# Altium schematic sheet WSB.SchDoc
size A; SheetNumber: 1; SheetTotal: 11
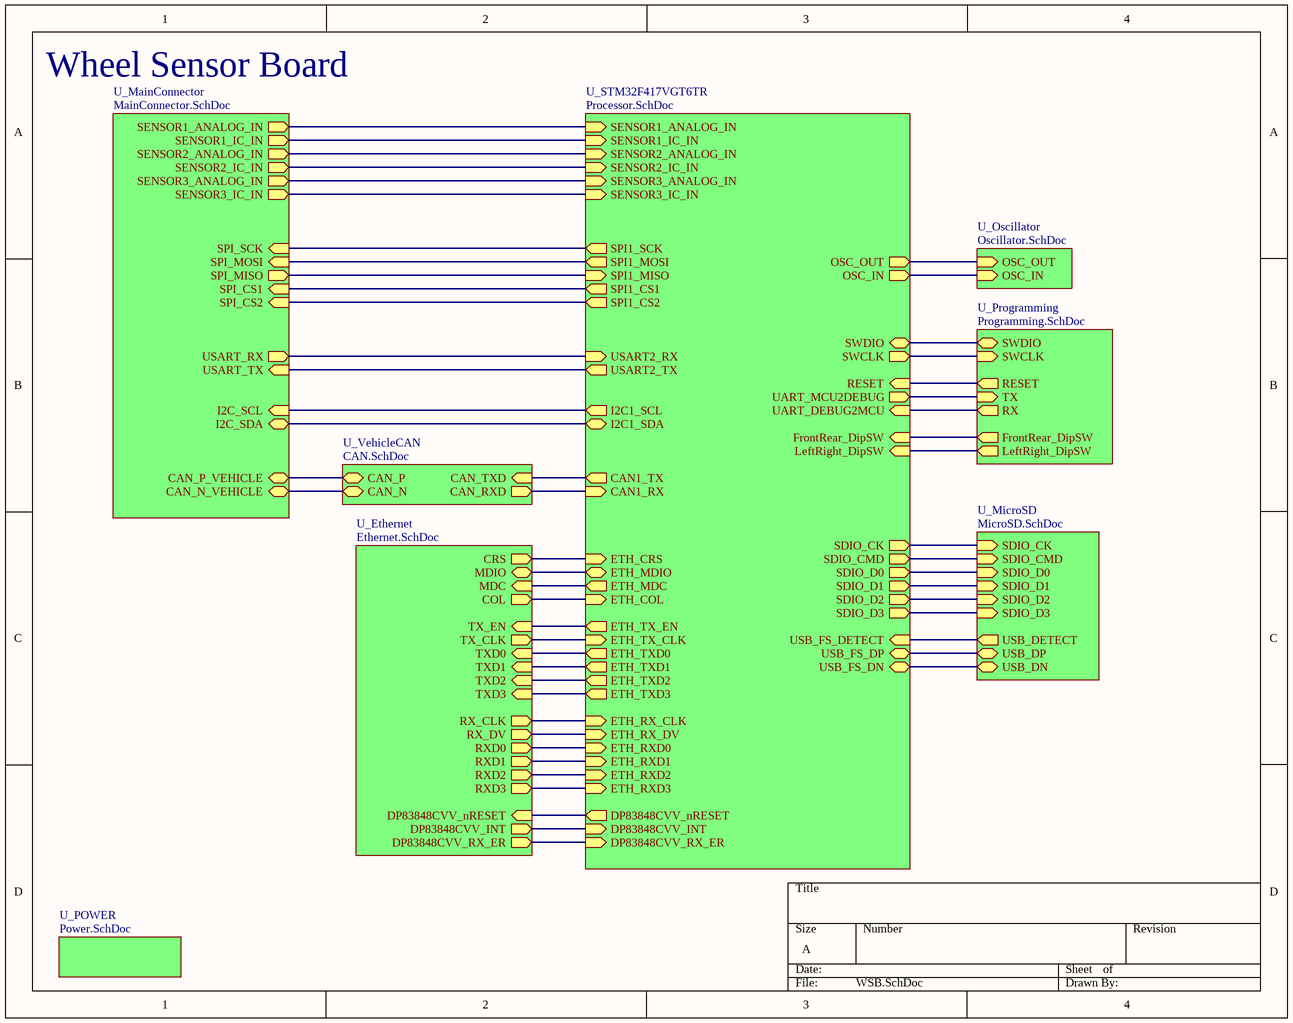
[diagram p0: WSB.SchDoc]

## Sub-sheets
U_Ethernet = Ethernet.SchDoc: DP83848CVV_INT (out), DP83848CVV_nRESET (in), CRS (out), RX_CLK (out), MDIO (bidir), COL (out), RX_DV (out), RXD2 (out), RXD3 (out), TX_EN (in), TXD0 (in), TXD1 (in), MDC (in), TXD2 (in), TX_CLK (out), RXD0 (out), RXD1 (out), TXD3 (in), DP83848CVV_RX_ER (out)
U_MainConnector = MainConnector.SchDoc: CAN_N_VEHICLE (bidir), CAN_P_VEHICLE (bidir), I2C_SDA (bidir), I2C_SCL (in), USART_TX (in), USART_RX (out), SPI_SCK (in), SPI_MOSI (in), SPI_MISO (out), SPI_CS1 (in), SPI_CS2 (in), SENSOR1_ANALOG_IN (out), SENSOR1_IC_IN (out), SENSOR2_ANALOG_IN (out), SENSOR2_IC_IN (out), SENSOR3_ANALOG_IN (out), SENSOR3_IC_IN (out)
U_MicroSD = MicroSD.SchDoc: SDIO_CK (in), SDIO_CMD (in), SDIO_D0 (in), SDIO_D1 (in), SDIO_D2 (in), SDIO_D3 (in), USB_DETECT (out), USB_DN (bidir), USB_DP (bidir)
U_Oscillator = Oscillator.SchDoc: OSC_IN (in), OSC_OUT (in)
U_POWER = Power.SchDoc: no entries
U_Programming = Programming.SchDoc: SWDIO (bidir), SWCLK (in), RESET (out), TX (in), RX (out), FrontRear_DipSW (out), LeftRight_DipSW (out)
U_STM32F417VGT6TR = Processor.SchDoc: SDIO_D0 (out), SDIO_D1 (out), SDIO_D2 (out), SDIO_D3 (out), SDIO_CK (out), SDIO_CMD (out), ETH_MDC (out), ETH_MDIO (bidir), I2C1_SCL (out), I2C1_SDA (bidir), SWDIO (bidir), SWCLK (out), UART_DEBUG2MCU (in), UART_MCU2DEBUG (out), CAN1_TX (out), RESET (in), ETH_COL (in), ETH_CRS (in), ETH_RXD0 (in), ETH_RXD1 (in), ETH_RXD2 (in), ETH_RXD3 (in), ETH_RX_CLK (in), ETH_RX_DV (in), ETH_TXD0 (out), ETH_TXD1 (out), ETH_TXD2 (out), ETH_TXD3 (out), ETH_TX_CLK (in), ETH_TX_EN (out), USB_FS_DN (bidir), USB_FS_DP (bidir), OSC_OUT (out), OSC_IN (out), USB_FS_DETECT (in), DP83848CVV_INT (in), DP83848CVV_nRESET (out), DP83848CVV_RX_ER (in), SPI1_SCK (out), SPI1_MOSI (out), USART2_TX (out), USART2_RX (in), SENSOR1_ANALOG_IN (in), SENSOR1_IC_IN (in), SPI1_MISO (in), SENSOR2_ANALOG_IN (in), SENSOR3_ANALOG_IN (in), SENSOR2_IC_IN (in), SENSOR3_IC_IN (in), FrontRear_DipSW (in), LeftRight_DipSW (in), CAN1_RX (in), SPI1_CS1 (out), SPI1_CS2 (out)
U_VehicleCAN = CAN.SchDoc: CAN_P (bidir), CAN_N (bidir), CAN_TXD (in), CAN_RXD (out)

## Nets
(unnamed): sheet U_MicroSD/SDIO_CK, sheet U_STM32F417VGT6TR/SDIO_CK
(unnamed): sheet U_MicroSD/SDIO_CMD, sheet U_STM32F417VGT6TR/SDIO_CMD
(unnamed): sheet U_MicroSD/SDIO_D0, sheet U_STM32F417VGT6TR/SDIO_D0
(unnamed): sheet U_MicroSD/SDIO_D1, sheet U_STM32F417VGT6TR/SDIO_D1
(unnamed): sheet U_MicroSD/SDIO_D2, sheet U_STM32F417VGT6TR/SDIO_D2
(unnamed): sheet U_MicroSD/SDIO_D3, sheet U_STM32F417VGT6TR/SDIO_D3
(unnamed): sheet U_MicroSD/USB_DETECT, sheet U_STM32F417VGT6TR/USB_FS_DETECT
(unnamed): sheet U_MicroSD/USB_DN, sheet U_STM32F417VGT6TR/USB_FS_DN
(unnamed): sheet U_MicroSD/USB_DP, sheet U_STM32F417VGT6TR/USB_FS_DP
(unnamed): sheet U_Programming/SWDIO, sheet U_STM32F417VGT6TR/SWDIO
(unnamed): sheet U_Programming/SWCLK, sheet U_STM32F417VGT6TR/SWCLK
(unnamed): sheet U_Programming/RESET, sheet U_STM32F417VGT6TR/RESET
(unnamed): sheet U_Programming/TX, sheet U_STM32F417VGT6TR/UART_MCU2DEBUG
(unnamed): sheet U_Programming/RX, sheet U_STM32F417VGT6TR/UART_DEBUG2MCU
(unnamed): sheet U_Programming/FrontRear_DipSW, sheet U_STM32F417VGT6TR/FrontRear_DipSW
(unnamed): sheet U_Programming/LeftRight_DipSW, sheet U_STM32F417VGT6TR/LeftRight_DipSW
(unnamed): sheet U_VehicleCAN/CAN_P, sheet U_MainConnector/CAN_P_VEHICLE
(unnamed): sheet U_VehicleCAN/CAN_N, sheet U_MainConnector/CAN_N_VEHICLE
(unnamed): sheet U_VehicleCAN/CAN_TXD, sheet U_STM32F417VGT6TR/CAN1_TX
(unnamed): sheet U_VehicleCAN/CAN_RXD, sheet U_STM32F417VGT6TR/CAN1_RX
(unnamed): sheet U_Oscillator/OSC_IN, sheet U_STM32F417VGT6TR/OSC_IN
(unnamed): sheet U_Oscillator/OSC_OUT, sheet U_STM32F417VGT6TR/OSC_OUT
(unnamed): sheet U_STM32F417VGT6TR/ETH_MDC, sheet U_Ethernet/MDC
(unnamed): sheet U_STM32F417VGT6TR/ETH_MDIO, sheet U_Ethernet/MDIO
(unnamed): sheet U_STM32F417VGT6TR/I2C1_SCL, sheet U_MainConnector/I2C_SCL
(unnamed): sheet U_STM32F417VGT6TR/I2C1_SDA, sheet U_MainConnector/I2C_SDA
(unnamed): sheet U_STM32F417VGT6TR/ETH_COL, sheet U_Ethernet/COL
(unnamed): sheet U_STM32F417VGT6TR/ETH_CRS, sheet U_Ethernet/CRS
(unnamed): sheet U_STM32F417VGT6TR/ETH_RXD0, sheet U_Ethernet/RXD0
(unnamed): sheet U_STM32F417VGT6TR/ETH_RXD1, sheet U_Ethernet/RXD1
(unnamed): sheet U_STM32F417VGT6TR/ETH_RXD2, sheet U_Ethernet/RXD2
(unnamed): sheet U_STM32F417VGT6TR/ETH_RXD3, sheet U_Ethernet/RXD3
(unnamed): sheet U_STM32F417VGT6TR/ETH_RX_CLK, sheet U_Ethernet/RX_CLK
(unnamed): sheet U_STM32F417VGT6TR/ETH_RX_DV, sheet U_Ethernet/RX_DV
(unnamed): sheet U_STM32F417VGT6TR/ETH_TXD0, sheet U_Ethernet/TXD0
(unnamed): sheet U_STM32F417VGT6TR/ETH_TXD1, sheet U_Ethernet/TXD1
(unnamed): sheet U_STM32F417VGT6TR/ETH_TXD2, sheet U_Ethernet/TXD2
(unnamed): sheet U_STM32F417VGT6TR/ETH_TXD3, sheet U_Ethernet/TXD3
(unnamed): sheet U_STM32F417VGT6TR/ETH_TX_CLK, sheet U_Ethernet/TX_CLK
(unnamed): sheet U_STM32F417VGT6TR/ETH_TX_EN, sheet U_Ethernet/TX_EN
(unnamed): sheet U_STM32F417VGT6TR/DP83848CVV_INT, sheet U_Ethernet/DP83848CVV_INT
(unnamed): sheet U_STM32F417VGT6TR/DP83848CVV_nRESET, sheet U_Ethernet/DP83848CVV_nRESET
(unnamed): sheet U_STM32F417VGT6TR/DP83848CVV_RX_ER, sheet U_Ethernet/DP83848CVV_RX_ER
(unnamed): sheet U_STM32F417VGT6TR/SPI1_SCK, sheet U_MainConnector/SPI_SCK
(unnamed): sheet U_STM32F417VGT6TR/SPI1_MOSI, sheet U_MainConnector/SPI_MOSI
(unnamed): sheet U_STM32F417VGT6TR/USART2_TX, sheet U_MainConnector/USART_TX
(unnamed): sheet U_STM32F417VGT6TR/USART2_RX, sheet U_MainConnector/USART_RX
(unnamed): sheet U_STM32F417VGT6TR/SENSOR1_ANALOG_IN, sheet U_MainConnector/SENSOR1_ANALOG_IN
(unnamed): sheet U_STM32F417VGT6TR/SENSOR1_IC_IN, sheet U_MainConnector/SENSOR1_IC_IN
(unnamed): sheet U_STM32F417VGT6TR/SPI1_MISO, sheet U_MainConnector/SPI_MISO
(unnamed): sheet U_STM32F417VGT6TR/SENSOR2_ANALOG_IN, sheet U_MainConnector/SENSOR2_ANALOG_IN
(unnamed): sheet U_STM32F417VGT6TR/SENSOR3_ANALOG_IN, sheet U_MainConnector/SENSOR3_ANALOG_IN
(unnamed): sheet U_STM32F417VGT6TR/SENSOR2_IC_IN, sheet U_MainConnector/SENSOR2_IC_IN
(unnamed): sheet U_STM32F417VGT6TR/SENSOR3_IC_IN, sheet U_MainConnector/SENSOR3_IC_IN
(unnamed): sheet U_STM32F417VGT6TR/SPI1_CS1, sheet U_MainConnector/SPI_CS1
(unnamed): sheet U_STM32F417VGT6TR/SPI1_CS2, sheet U_MainConnector/SPI_CS2

## Notes on the sheet
- Wheel Sensor Board